# Altium schematic sheet 2轴6.0.SchDoc
size A3
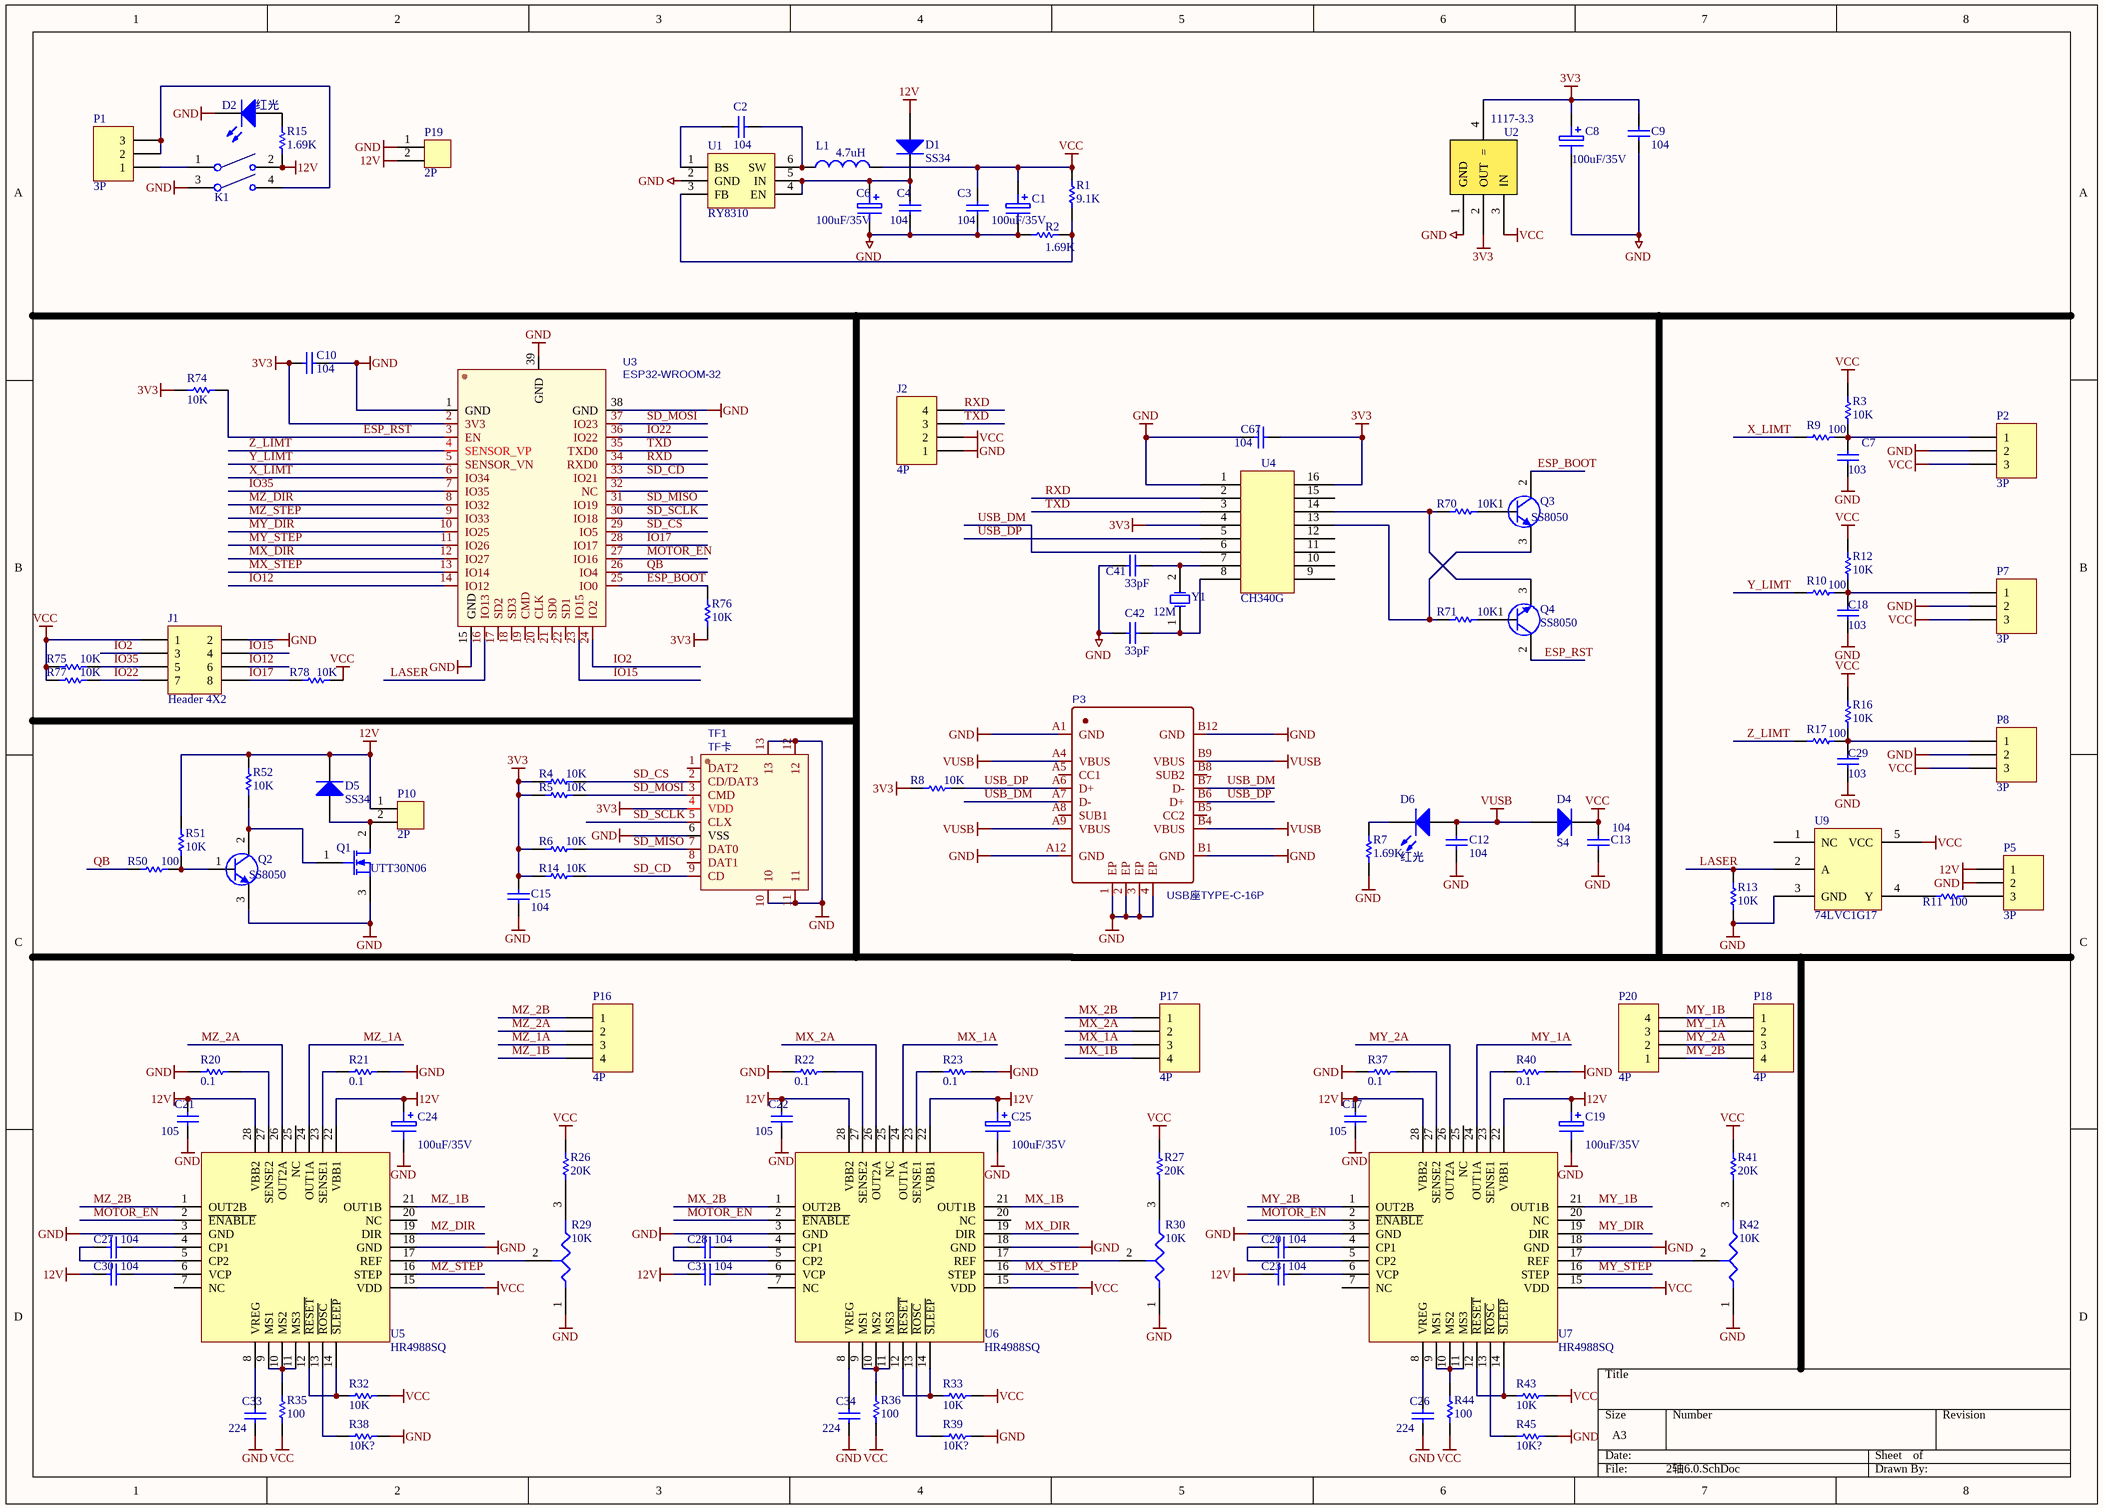
[diagram p0: 2轴6.0.SchDoc]

## Parts
C1  100uF/35V  [电解电容贴片6x6]
C2  104  [0603C]
C3  104  [0603C]
C4  104  [0603C]
C6  100uF/35V  [电解电容贴片6x6]
C7  103  [0603C]
C8  100uF/35V  [电解电容贴片6x6]
C9  104  [0603C]
C10  104  [0603C]
C12  104  [0603C]
C13  104  [0603C]
C15  104  [0603C]
C17  105  [0805C]
C18  103  [0603C]
C19  100uF/35V  [电解电容贴片6x6]
C20  104  [0603C]
C21  105  [0805C]
C22  105  [0805C]
C23  104  [0603C]
C24  100uF/35V  [电解电容贴片6x6]
C25  100uF/35V  [电解电容贴片6x6]
C26  224  [0603C]
C27  104  [0603C]
C28  104  [0603C]
C29  103  [0603C]
C30  104  [0603C]
C31  104  [0603C]
C33  224  [0603C]
C34  224  [0603C]
C41  33pF  [0603C]
C42  33pF  [0603C]
C67  104  [0603C]
D1  SS34  [SMA]
D2  红光  [0603LED]
D4  S4  [SOD-123]
D5  SS34  [SMA]
D6  红光  [0603LED]
J1  Header 4X2  [HDR2X4]
J2  4P  [SIP4]
K1  船形开关  [船形开关KCD1-104-4P]  (value not drawn)
L1  4.7uH  [电感贴片7x7]
P1  3P  [DC0044A]
P2  3P  [HDR1X3_P]
P3  USB座TYPE-C-16P  [USB-TYPE-C-16P]
P5  3P  [HDR1X3_P]
P7  3P  [HDR1X3_P]
P8  3P  [HDR1X3_P]
P10  2P  [HDR1X2_P]
P16  4P  [HDR1X4_P]
P17  4P  [HDR1X4_P]
P18  4P  [HDR1X4_P]
P19  2P  [HDR1X2_P]
P20  4P  [HDR1X4_P]
Q1  UTT30N06  [TO-252]
Q2  SS8050  [SOT-23]
Q3  SS8050  [SOT-23]
Q4  SS8050  [SOT-23]
R1  9.1K  [0603R]
R2  1.69K  [0603R]
R3  10K  [0603R]
R4  10K  [0603R]
R5  10K  [0603R]
R6  10K  [0603R]
R7  1.69K  [0603R]
R8  10K  [0603R]
R9  100  [0603R]
R10  100  [0603R]
R11  100  [0603R]
R12  10K  [0603R]
R13  10K  [0603R]
R14  10K  [0603R]
R15  1.69K  [0603R]
R16  10K  [0603R]
R17  100  [0603R]
R20  0.1  [0805R]
R21  0.1  [0805R]
R22  0.1  [0805R]
R23  0.1  [0805R]
R26  20K  [0603R]
R27  20K  [0603R]
R29  10K  [松下贴片电位器3x3]
R30  10K  [松下贴片电位器3x3]
R32  10K  [0603R]
R33  10K  [0603R]
R35  100  [0603R]
R36  100  [0603R]
R37  0.1  [0805R]
R38  10K?  [0603R]
R39  10K?  [0603R]
R40  0.1  [0805R]
R41  20K  [0603R]
R42  10K  [松下贴片电位器3x3]
R43  10K  [0603R]
R44  100  [0603R]
R45  10K?  [0603R]
R50  100  [0603R]
R51  10K  [0603R]
R52  10K  [0603R]
R70  10K  [0603R]
R71  10K  [0603R]
R74  10K  [0603R]
R75  10K  [0603R]
R76  10K  [0603R]
R77  10K  [0603R]
R78  10K  [0603R]
TF1  TF卡  [TF卡自弹式]
U1  RY8310  [SOT-23-6]
U2  1117-3.3  [SOT-223]
U3  ESP32-WROOM-32  [WIFIM-SMD_38P-L25.5-W18.0-P1.27]
U4  CH340G  [SOP16]
U5  HR4988SQ  [QFN28]
U6  HR4988SQ  [QFN28]
U7  HR4988SQ  [QFN28]
U9  74LVC1G17  [SOT-23-5]
Y1  12M  [晶振贴片49SSMD]

## Nets
3V3: C8.1 C9.2 C10.2 C15.2 C67.2 R4.2 R5.2 R6.2 R8.1 R14.2 R74.2 R76.1 TF1.4(VDD) U2.2(OUT) U2.4(=) U3.2(3V3) U4.4 U4.16
12V: C17.1 C19.1 C21.1 C22.1 C23.2 C24.1 C25.1 C30.2 C31.2 D1.1 D5.2 K1.2 P5.1 P10.1 P19.2 R15.2 R51.1 R52.1 U5.22(VBB1) U5.28(VBB2) U6.22(VBB1) U6.28(VBB2) U7.22(VBB1) U7.28(VBB2)
GND: C1.2 C3.1 C4.2 C6.2 C7.1 C8.2 C9.1 C10.1 C12.1 C13.1 C15.1 C17.2 C18.1 C19.2 C21.2 C22.2 C24.2 C25.2 C26.2 C29.1 C33.2 C34.2 C41.2 C42.2 C67.1 D2.2 J1.2 J2.1 K1.3 P2.2 P3.1(EP) P3.2(EP) P3.3(EP) P3.4(EP) P3.A1(GND) P3.A12(GND) P3.B1(GND) P3.B12(GND) P5.2 P7.2 P8.2 P19.1 Q1.3(S) Q2.3(E) R2.1 R7.1 R13.1 R20.2 R21.1 R22.2 R23.1 R29.1(A) R30.1(A) R37.2 R38.2 R39.2 R40.1 R42.1(A) R45.2 TF1.6(VSS) TF1.10 TF1.11 TF1.12 TF1.13 U1.2(GND) U2.1(GND) U3.1(GND) U3.15(GND) U3.38(GND) U3.39(GND) U4.1 U5.3(GND) U5.18(GND) U6.3(GND) U6.18(GND) U7.3(GND) U7.18(GND) U9.3(GND)
VCC: C1.1 C3.2 C13.2 D4.2 J1.1 J2.2 L1.2 P2.3 P7.3 P8.3 R1.2 R3.2 R12.2 R16.2 R26.2 R27.2 R32.1 R33.1 R35.1 R36.1 R41.2 R43.1 R44.1 R75.2 R77.2 R78.1 U2.3(IN) U5.15(VDD) U6.15(VDD) U7.15(VDD) U9.5(VCC)
VUSB: C12.2 D4.1 D6.1 P3.A4(VBUS) P3.A9(VBUS) P3.B4(VBUS) P3.B9(VBUS)
ESP_BOOT: Q3.2(C) R76.2 U3.25(IO0)
ESP_RST: Q4.2(C) R74.1 U3.3(EN)
IO2: J1.3 U3.24(IO2)
IO12: J1.6 U3.14(IO12)
IO15: J1.4 U3.23(IO15)
IO17: J1.8 R78.2 U3.28(IO17)
IO22: J1.7 R77.1 U3.36(IO22)
IO35: J1.5 R75.1 U3.7(IO35)
LASER: R13.2 U3.16(IO13) U9.2(A)
MOTOR_EN: U3.27(IO16) U5.2(~{ENABLE}) U6.2(~{ENABLE}) U7.2(~{ENABLE})
MX_1A: P17.3 U6.24(OUT1A)
MX_1B: P17.4 U6.21(OUT1B)
MX_2A: P17.2 U6.26(OUT2A)
MX_2B: P17.1 U6.1(OUT2B)
MX_DIR: U3.12(IO27) U6.19(DIR)
MX_STEP: U3.13(IO14) U6.16(STEP)
MY_1A: P18.2 P20.3 U7.24(OUT1A)
MY_1B: P18.1 P20.4 U7.21(OUT1B)
MY_2A: P18.3 P20.2 U7.26(OUT2A)
MY_2B: P18.4 P20.1 U7.1(OUT2B)
MY_DIR: U3.10(IO25) U7.19(DIR)
MY_STEP: U3.11(IO26) U7.16(STEP)
MZ_1A: P16.3 U5.24(OUT1A)
MZ_1B: P16.4 U5.21(OUT1B)
MZ_2A: P16.2 U5.26(OUT2A)
MZ_2B: P16.1 U5.1(OUT2B)
MZ_DIR: U3.8(IO32) U5.19(DIR)
MZ_STEP: U3.9(IO33) U5.16(STEP)
QB: R50.2 U3.26(IO4)
RXD: J2.4 U3.34(RXD0) U4.2
SD_CD: R14.1 TF1.9(CD) U3.33(IO21)
SD_CS: R4.1 TF1.2(CD/DAT3) U3.29(IO5)
SD_MISO: R6.1 TF1.7(DAT0) U3.31(IO19)
SD_MOSI: R5.1 TF1.3(CMD) U3.37(IO23)
SD_SCLK: TF1.5(CLX) U3.30(IO18)
TXD: J2.3 U3.35(TXD0) U4.3
USB_DM: P3.A7(D-) P3.B7(D-) U4.6
USB_DP: P3.A6(D+) P3.B6(D+) R8.2 U4.5
X_LIMT: R9.2 U3.6(IO34)
Y_LIMT: R10.2 U3.5(SENSOR_VN)
Z_LIMT: R17.2 U3.4(SENSOR_VP)
NetC2_1: C2.1 L1.1 U1.6(SW)
NetC2_2: C2.2 U1.1(BS)
NetC4_1: C4.1 C6.1 D1.2 U1.4(EN) U1.5(IN)
NetC7_2: C7.2 P2.1 R3.1 R9.1
NetC18_2: C18.2 P7.1 R10.1 R12.1
NetC20_1: C20.1 U7.4(CP1)
NetC20_2: C20.2 U7.5(CP2)
NetC23_1: C23.1 U7.6(VCP)
NetC26_1: C26.1 U7.8(VREG)
NetC27_1: C27.1 U5.4(CP1)
NetC27_2: C27.2 U5.5(CP2)
NetC28_1: C28.1 U6.4(CP1)
NetC28_2: C28.2 U6.5(CP2)
NetC29_2: C29.2 P8.1 R16.1 R17.1
NetC30_1: C30.1 U5.6(VCP)
NetC31_1: C31.1 U6.6(VCP)
NetC33_1: C33.1 U5.8(VREG)
NetC34_1: C34.1 U6.8(VREG)
NetC41_1: C41.1 U4.7 Y1.2(OSC2)
NetC42_1: C42.1 U4.8 Y1.1(OSC1)
NetD2_1: D2.1 R15.1
NetD5_1: D5.1 P10.2 Q1.2(D)
NetD6_2: D6.2 R7.2
NetK1_1: K1.1 P1.1
NetK1_4: K1.4 P1.2 P1.3
NetP5_3: P5.3 R11.2
NetQ1_1: Q1.1(G) Q2.2(C) R52.2
NetQ2_1: Q2.1(B) R50.1 R51.2
NetQ3_1: Q3.1(B) R70.1
NetQ3_3: Q3.3(E) R71.2 U4.13
NetQ4_1: Q4.1(B) R71.1
NetQ4_3: Q4.3(E) R70.2 U4.14
NetR1_1: R1.1 R2.2 U1.3(FB)
NetR11_1: R11.1 U9.4(Y)
NetR20_1: R20.1 U5.27(SENSE2)
NetR21_2: R21.2 U5.23(SENSE1)
NetR22_1: R22.1 U6.27(SENSE2)
NetR23_2: R23.2 U6.23(SENSE1)
NetR26_1: R26.1 R29.3(B)
NetR27_1: R27.1 R30.3(B)
NetR29_2: R29.2(TAP) U5.17(REF)
NetR30_2: R30.2(TAP) U6.17(REF)
NetR32_2: R32.2 U5.12(~{RESET}) U5.14(~{SLEEP})
NetR33_2: R33.2 U6.12(~{RESET}) U6.14(~{SLEEP})
NetR35_2: R35.2 U5.9(MS1) U5.10(MS2) U5.11(MS3)
NetR36_2: R36.2 U6.9(MS1) U6.10(MS2) U6.11(MS3)
NetR37_1: R37.1 U7.27(SENSE2)
NetR38_1: R38.1 U5.13(~{ROSC})
NetR39_1: R39.1 U6.13(~{ROSC})
NetR40_2: R40.2 U7.23(SENSE1)
NetR41_1: R41.1 R42.3(B)
NetR42_2: R42.2(TAP) U7.17(REF)
NetR43_2: R43.2 U7.12(~{RESET}) U7.14(~{SLEEP})
NetR44_2: R44.2 U7.9(MS1) U7.10(MS2) U7.11(MS3)
NetR45_1: R45.1 U7.13(~{ROSC})

Not connected (* = marked no-connect by the designer): P3 A5(CC1) A8(SUB1) B5(CC2) B8(SUB2); TF1 1(DAT2) 8(DAT1); U3 17(SD2) 18(SD3) 19(CMD) 20(CLK) 21(SD0) 22(SD1) 32(NC); U4 9 10 11 12 15; U5 7(NC) 20(NC) 25(NC); U6 7(NC) 20(NC) 25(NC); U7 7(NC) 20(NC) 25(NC); U9 1(NC)

## Library data of the parts
C1 C6 C8 C19 C24 C25 = ELECTRO1
C2 C4 C7 C17 C18 C20-C23 C26-C31 C33 C34 = CAP
C3 C9 C10 C12 C13 C15 C67 = Cap Semi: Capacitor (Semiconductor SIM Model); Published: 8-Jun-2000; LatestRevisionDate: 17-Jul-2002; LatestRevisionNote: Re-released for DXP Platform.; PackageReference: C1206; Publisher: Altium Limited
  C3 C9 C10 C12 C15: Value: 104
C41 C42 = Cap Semi: Capacitor (Semiconductor SIM Model); Value: 18pF; Published: 8-Jun-2000; LatestRevisionDate: 17-Jul-2002; LatestRevisionNote: Re-released for DXP Platform.; PackageReference: C1206; Publisher: Altium Limited
D1 D4 D5 = 1N4148
D2 D6 = LED
J1 = Header 4X2: Header, 4-Pin, Dual row; LatestRevisionDate: 17-Jul-2002; LatestRevisionNote: Re-released for DXP Platform.; Publisher: Altium Limited
K1 = 船形开关双刀
L1 = Inductor: Code_IEC: 1005; Published: 8-Jun-2000; LatestRevisionDate: 29-May-2009; LatestRevisionNote: IPC-7351 Footprint Added.; PackageReference: 0402-A; Publisher: Altium Limited; PackageDescription: Chip Inductor; Code_JEITA: 0402
P3 = USB座TYPE-C-16P: BOM_Manufacturer: Shenzhen Kinghelm Elec; BOM_Manufacturer Part: KH-TYPE-C-16P-T; Contributor: LCSC; BOM_Supplier: LCSC; BOM_Supplier Part: C709358; spicePre: U; spiceSymbolName: KH-TYPE-C-16P-T
Q1 = MOSFET-N: N-Channel MOSFET; Published: 8-Jun-2000; LatestRevisionDate: 17-Jul-2002; LatestRevisionNote: Re-released for DXP Platform.; PackageVersion: 1995/1996; PackageReference: E3; Publisher: Altium Limited
Q2-Q4 = NPN: Published: 8-Jun-2000; LatestRevisionDate: 17-Jul-2002; LatestRevisionNote: Re-released for DXP Platform.; PackageReference: TO-226; Publisher: Altium Limited; Code_JEDEC: TO-226-AA
R1-R17 R20-R23 R26 R27 R32 R33 R35-R41 R43-R45 R50-R52 R70 R71 R74-R78 = RES: Resistor; Published: 8-Jun-2000; LatestRevisionDate: 17-Jul-2002; LatestRevisionNote: Re-released for DXP Platform.; PackageReference: AXIAL-0.3; Publisher: Altium Limited
R29 R30 R42 = 电位器
TF1 = TF-012: BOM_Manufacturer: Hanbo Electronic; Contributor: LCSC; BOM_Supplier: LCSC; BOM_Supplier Part: C410350; BOM_Manufacturer Part: TF-012; spicePre: T; spiceSymbolName: TF-012
U2 = LM1117
U3 = ESP32-WROOM-32DC: BOM_Manufacturer: Espressif Systems; Contributor: LCSC; BOM_Supplier: LCSC; BOM_Supplier Part: C473013; BOM_Manufacturer Part: ESP32-WROOM-32DC; spicePre: U; spiceSymbolName: ESP32-WROOM-32DC
U4 = DIP16
U5-U7 = HR4988
Y1 = XTAL: Crystal Oscillator; Published: 8-Jun-2000; LatestRevisionDate: 17-Jul-2002; LatestRevisionNote: Re-released for DXP Platform.; PackageReference: R38; Publisher: Altium Limited